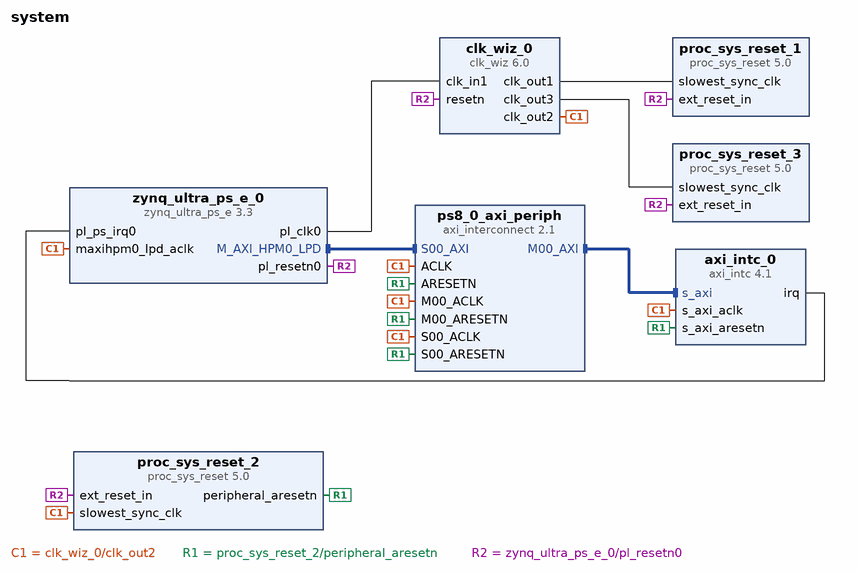
[diagram p0: block diagram of the top level]
# Vivado block design system, xck26-sfvc784-2LV-c, Vivado 2021.1.1
create_bd_design system

create_bd_cell -type ip -vlnv xilinx.com:ip:zynq_ultra_ps_e:3.3 zynq_ultra_ps_e_0
set_property -dict [list \
  CONFIG.PSU__DDR_HIGH_ADDRESS_GUI_ENABLE 0 \
  CONFIG.PSU__USE__IRQ0 1 \
  CONFIG.PSU__USE__M_AXI_GP2 1 \
] [get_bd_cells zynq_ultra_ps_e_0]
# 4 more settings of zynq_ultra_ps_e_0 are not shown: defaults, MIO pin electricals, DDR timing, and values the tool derives
create_bd_cell -type ip -vlnv xilinx.com:ip:clk_wiz:6.0 clk_wiz_0
set_property -dict [list \
  CONFIG.CLKOUT2_JITTER 102.198 \
  CONFIG.CLKOUT2_PHASE_ERROR 87.180 \
  CONFIG.CLKOUT2_REQUESTED_OUT_FREQ 200 \
  CONFIG.CLKOUT2_USED true \
  CONFIG.CLKOUT3_JITTER 90.201 \
  CONFIG.CLKOUT3_PHASE_ERROR 87.180 \
  CONFIG.CLKOUT3_REQUESTED_OUT_FREQ 400 \
  CONFIG.CLKOUT3_USED true \
  CONFIG.MMCM_CLKOUT1_DIVIDE 6 \
  CONFIG.MMCM_CLKOUT2_DIVIDE 3 \
  CONFIG.NUM_OUT_CLKS 3 \
  CONFIG.OPTIMIZE_CLOCKING_STRUCTURE_EN true \
  CONFIG.RESET_PORT resetn \
  CONFIG.RESET_TYPE ACTIVE_LOW \
] [get_bd_cells clk_wiz_0]
create_bd_cell -type ip -vlnv xilinx.com:ip:proc_sys_reset:5.0 proc_sys_reset_3
create_bd_cell -type ip -vlnv xilinx.com:ip:proc_sys_reset:5.0 proc_sys_reset_1
create_bd_cell -type ip -vlnv xilinx.com:ip:proc_sys_reset:5.0 proc_sys_reset_2
create_bd_cell -type ip -vlnv xilinx.com:ip:axi_intc:4.1 axi_intc_0
set_property -dict {CONFIG.C_IRQ_CONNECTION 1} [get_bd_cells axi_intc_0]
create_bd_cell -type ip -vlnv xilinx.com:ip:axi_interconnect:2.1 ps8_0_axi_periph
set_property -dict {CONFIG.NUM_MI 1} [get_bd_cells ps8_0_axi_periph]

# ---- connections ----

connect_bd_intf_net [get_bd_intf_pins ps8_0_axi_periph/M00_AXI] [get_bd_intf_pins axi_intc_0/s_axi]
connect_bd_intf_net [get_bd_intf_pins zynq_ultra_ps_e_0/M_AXI_HPM0_LPD] [get_bd_intf_pins ps8_0_axi_periph/S00_AXI]
connect_bd_net [get_bd_pins axi_intc_0/irq] [get_bd_pins zynq_ultra_ps_e_0/pl_ps_irq0]
connect_bd_net [get_bd_pins clk_wiz_0/clk_out1] [get_bd_pins proc_sys_reset_1/slowest_sync_clk]
connect_bd_net [get_bd_pins clk_wiz_0/clk_out2] \
  [get_bd_pins proc_sys_reset_2/slowest_sync_clk] [get_bd_pins zynq_ultra_ps_e_0/maxihpm0_lpd_aclk] \
  [get_bd_pins ps8_0_axi_periph/S00_ACLK] [get_bd_pins axi_intc_0/s_axi_aclk] [get_bd_pins ps8_0_axi_periph/M00_ACLK] \
  [get_bd_pins ps8_0_axi_periph/ACLK]
connect_bd_net [get_bd_pins clk_wiz_0/clk_out3] [get_bd_pins proc_sys_reset_3/slowest_sync_clk]
connect_bd_net [get_bd_pins proc_sys_reset_2/peripheral_aresetn] \
  [get_bd_pins ps8_0_axi_periph/S00_ARESETN] [get_bd_pins axi_intc_0/s_axi_aresetn] \
  [get_bd_pins ps8_0_axi_periph/M00_ARESETN] [get_bd_pins ps8_0_axi_periph/ARESETN]
connect_bd_net [get_bd_pins zynq_ultra_ps_e_0/pl_clk0] [get_bd_pins clk_wiz_0/clk_in1]
connect_bd_net [get_bd_pins zynq_ultra_ps_e_0/pl_resetn0] \
  [get_bd_pins clk_wiz_0/resetn] [get_bd_pins proc_sys_reset_2/ext_reset_in] [get_bd_pins proc_sys_reset_1/ext_reset_in] \
  [get_bd_pins proc_sys_reset_3/ext_reset_in]
set_property PFM.AXI_PORT {M_AXI_HPM0_FPD {memport "M_AXI_GP" sptag "" memory "" is_range "false"} M_AXI_HPM1_FPD {memport "M_AXI_GP" sptag "" memory "" is_range "false"} S_AXI_HPC0_FPD {memport "S_AXI_HP" sptag "HPC0" memory "" is_range "false"} S_AXI_HPC1_FPD {memport "S_AXI_HP" sptag "HPC1" memory "" is_range "false"} S_AXI_HP0_FPD {memport "S_AXI_HP" sptag "HP0" memory "" is_range "false"} S_AXI_HP1_FPD {memport "S_AXI_HP" sptag "HP1" memory "" is_range "false"} S_AXI_HP2_FPD {memport "S_AXI_HP" sptag "HP2" memory "" is_range "false"} S_AXI_HP3_FPD {memport "S_AXI_HP" sptag "HP3" memory "" is_range "false"}} [get_bd_cells zynq_ultra_ps_e_0]
set_property PFM.CLOCK {clk_out1 {id "0" is_default "false" proc_sys_reset "/proc_sys_reset_1" status "fixed" freq_hz "100000000"} clk_out2 {id "1" is_default "true" proc_sys_reset "/proc_sys_reset_2" status "fixed" freq_hz "200000000"} clk_out3 {id "2" is_default "false" proc_sys_reset "/proc_sys_reset_3" status "fixed" freq_hz "400000000"}} [get_bd_cells clk_wiz_0]
set_property PFM.IRQ {intr { id 0 range 32 }} [get_bd_cells axi_intc_0]
set_property PFM.AXI_PORT {M01_AXI {memport "M_AXI_GP" sptag "" memory "" is_range "false"} M02_AXI {memport "M_AXI_GP" sptag "" memory "" is_range "false"} M03_AXI {memport "M_AXI_GP" sptag "" memory "" is_range "false"} M04_AXI {memport "M_AXI_GP" sptag "" memory "" is_range "false"} M05_AXI {memport "M_AXI_GP" sptag "" memory "" is_range "false"} M06_AXI {memport "M_AXI_GP" sptag "" memory "" is_range "false"} M07_AXI {memport "M_AXI_GP" sptag "" memory "" is_range "false"}} [get_bd_cells ps8_0_axi_periph]

# ---- address map ----
assign_bd_address -offset 0x0080000000 -range 64K -target_address_space [get_bd_addr_spaces zynq_ultra_ps_e_0/Data] [get_bd_addr_segs axi_intc_0/S_AXI/Reg]

validate_bd_design
save_bd_design
